# EAGLE design 4ch-v1.0 (EAGLE 5.06)
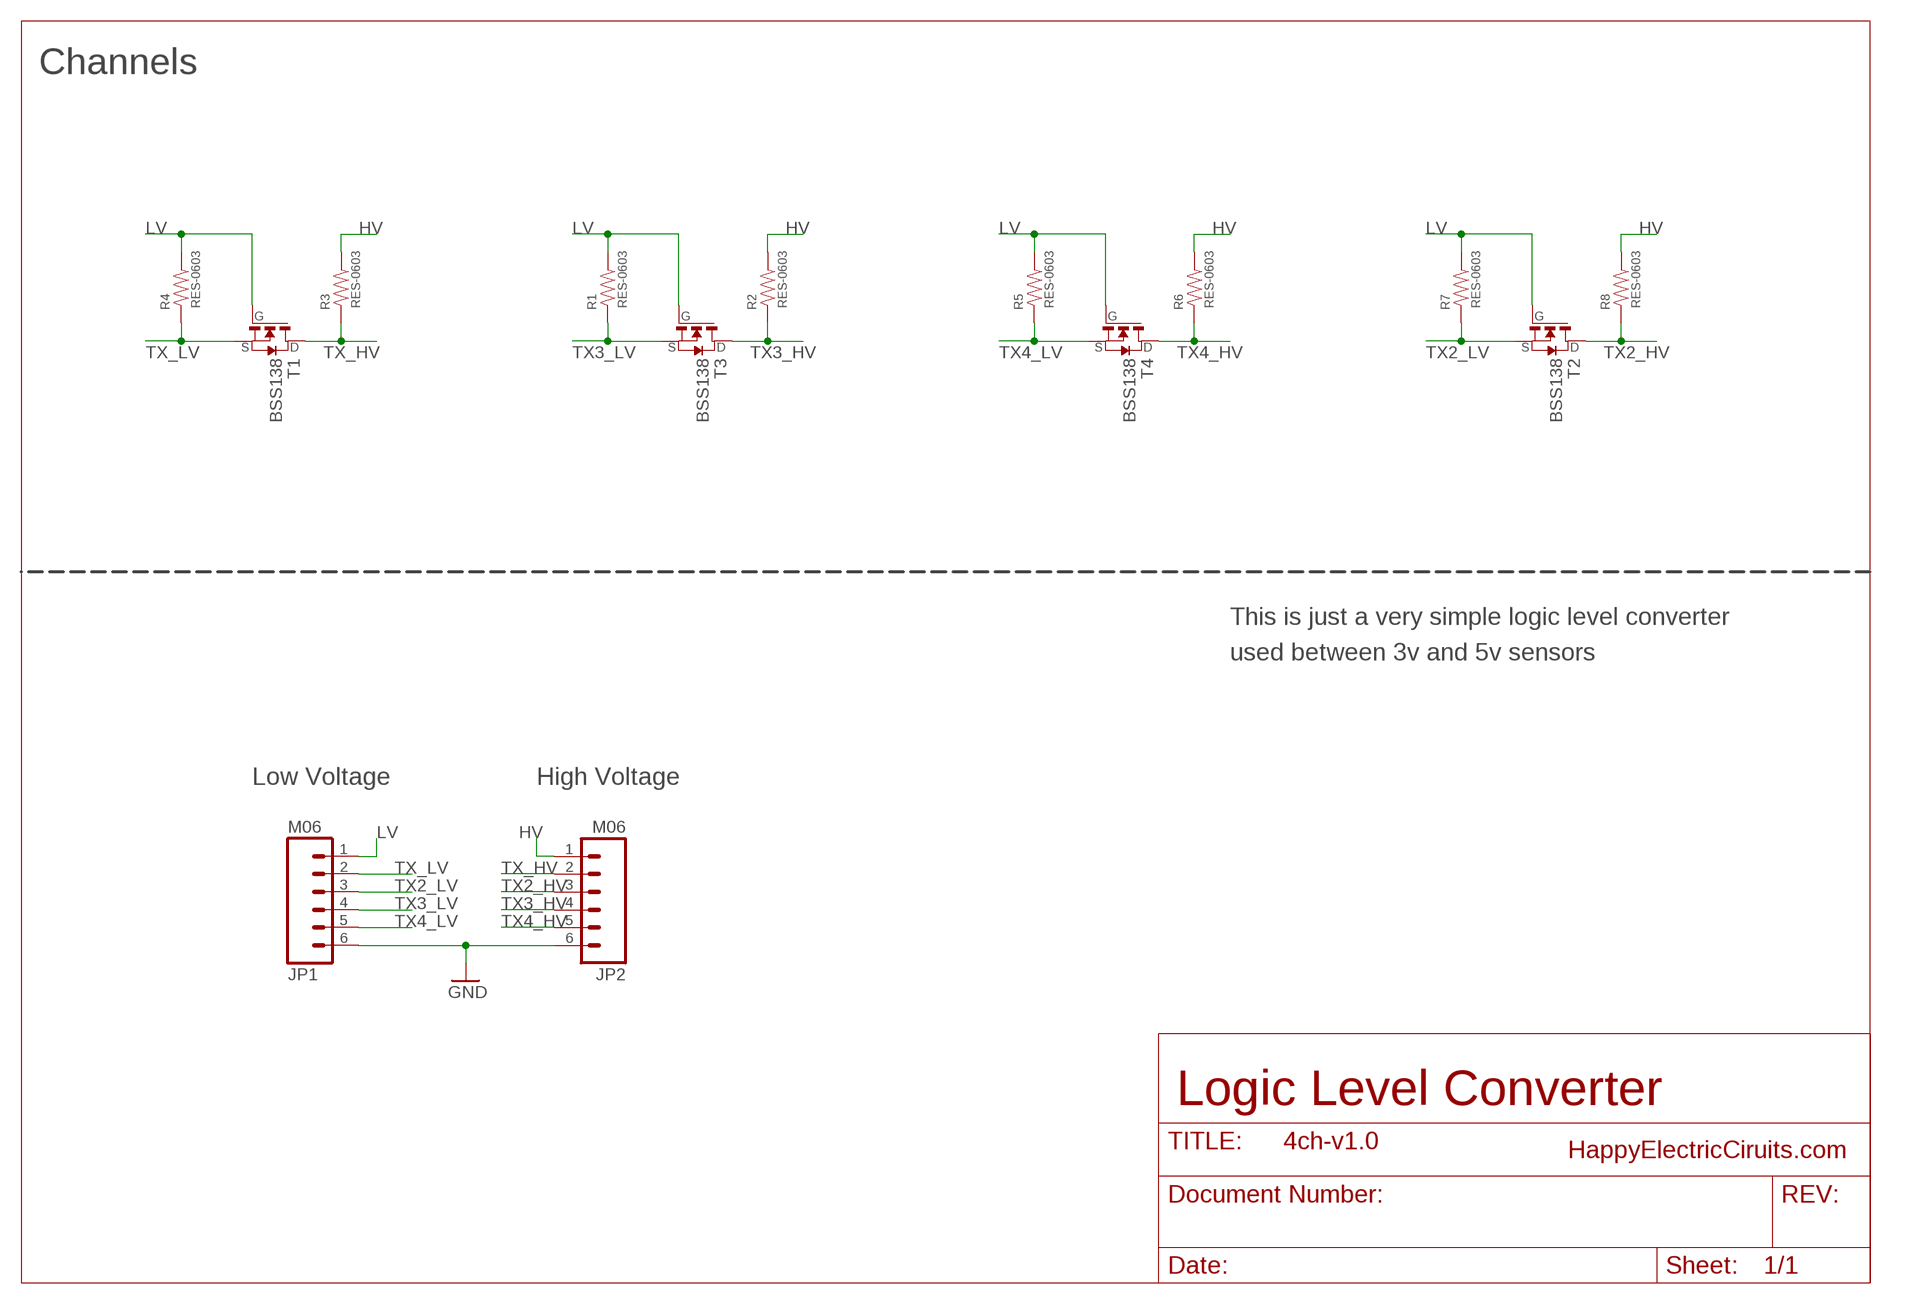
[diagram p0: schematic, sheet 1]

## Parts
JP1  M06  [M06]
JP2  M06  [M06]
R1  RES-0603  [0603-RES]
R2  RES-0603  [0603-RES]
R3  RES-0603  [0603-RES]
R4  RES-0603  [0603-RES]
R5  RES-0603  [0603-RES]
R6  RES-0603  [0603-RES]
R7  RES-0603  [0603-RES]
R8  RES-0603  [0603-RES]
T1  BSS138  [SOT-23]
T2  BSS138  [SOT-23]
T3  BSS138  [SOT-23]
T4  BSS138  [SOT-23]

## Nets
GND: JP1.6 JP2.6
HV: JP2.1 R2.1 R3.1 R6.1 R8.1
LV: JP1.1 R1.1 R4.1 R5.1 R7.1 T1.1(G) T2.1(G) T3.1(G) T4.1(G)
TX2_HV: JP2.3 R8.2 T2.3(D)
TX2_LV: JP1.3 R7.2 T2.2(S)
TX3_HV: JP2.4 R2.2 T3.3(D)
TX3_LV: JP1.4 R1.2 T3.2(S)
TX4_HV: JP2.5 R6.2 T4.3(D)
TX4_LV: JP1.5 R5.2 T4.2(S)
TX_HV: JP2.2 R3.2 T1.3(D)
TX_LV: JP1.2 R4.2 T1.2(S)

## Notes on the sheet
- Channels
- This is just a very simple logic level converter
- used between 3v and 5v sensors
- Low Voltage | High Voltage
- Logic Level Converter
- HappyElectricCiruits.com

## Library data of the parts
JP1 JP2 = Travis:M06
R1-R8 = Travis:RES-0603
T1-T4 = Travis:BSS138

## Board
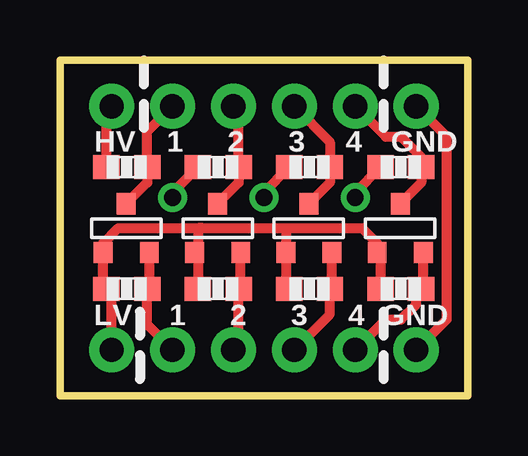
[diagram p1: board, top side]
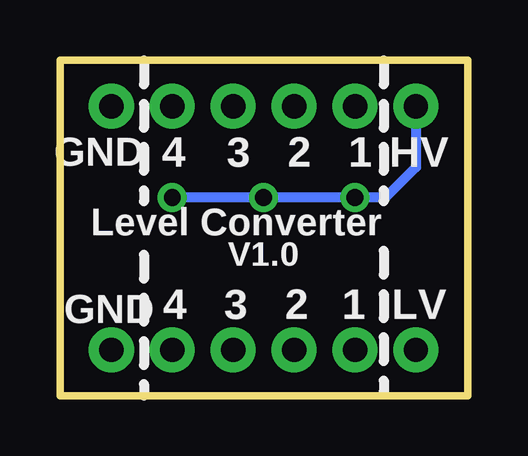
[diagram p2: board, bottom side, seen from below]

Size 17 x 14 mm. Coordinates in mm from the lower left corner, seen from the top.
Outline: 0,0 0,14 17,14 17,0 0,0
Copper layers (1*16): Top 0.035mm / dielectric 1.5mm / Bottom 0.035mm
Design rules "SparkFun *": minimum track width 8mil, minimum drill 20mil, track to track 8mil, track to pad 8mil, pad to pad 8mil, via to via 8mil, smd to smd 8mil, copper to edge 10mil, drill to drill 8mil, minimum pad ring 12mil, minimum via ring 10mil, stop-mask expansion 4mil, vias tented up to drill 28mil, thermal gap 10mil

### Footprints (pad centres in the part's own frame; a part is rotated, then mirrored left to right if it is on the bottom)
M06 = drill 1.016 pad 1.88 round: 1 0,0; 2 2.54,0; 3 5.08,0; 4 7.62,0; 5 10.16,0; 6 12.7,0
0603-RES = smd 1.1 x 1: 1 -0.85,0; 2 0.85,0
SOT-23 = smd 0.787 x 0.889: 1 -0.991,-1.016; 2 0.94,-1.016; 3 -0.025,1.016

### Placement (x,y rotation side)
JP1  2.15,1.91 0 top
JP2  2.15,12.06 0 top
R1  10.41,4.45 0 top
R2  10.41,9.53 0 top
R3  2.79,9.53 0 top
R4  2.79,4.45 0 top
R5  14.22,4.45 0 top
R6  14.22,9.53 0 top
R7  6.6,4.45 0 top
R8  6.6,9.53 0 top
T1  2.79,6.99 0 top
T2  6.6,6.99 0 top
T3  10.41,6.99 0 top
T4  14.22,6.99 0 top

### Tracks (layer width: path | path; a pad name or v marks a point on that pad's centre or on a via)
GND
  Top 0.406: JP2.6 16.12,10.79 16.12,3.17 JP1.6
HV  (via drill 0.7)
  Top 0.406: JP2.1 1.94,11.85 R3.1 | R6.1 12.31,8.47 v12.31,8.26 | R2.1 8.51,8.47 v8.51,8.26 | R8.1 4.7,8.47 v4.7,8.26
  Bottom 0.406: JP2.1 2.15,9.53 3.42,8.26 v4.7,8.26 v8.51,8.26 v12.31,8.26
LV
  Top 0.406: JP1.1 2.15,4.23 R4.1 1.8,4.45 T1.1 1.8,6.35 2.43,6.99 5.96,6.99 | 5.75,5.83 T2.1 | 5.75,5.83 R7.1 | R5.1 13.37,5.83 T4.1 13.23,6.35 12.59,6.99 9.14,6.99 | R1.1 9.42,4.45 T3.1 9.42,6.99 9.14,6.99 | 5.96,6.99 9.14,6.99 | 5.75,5.83 5.75,6.99 5.96,6.99
TX2_HV
  Top 0.406: JP2.3 7.45,11.85 R8.2 7.45,8.88 T2.3
TX2_LV
  Top 0.406: T2.2 7.54,4.54 R7.2 7.45,2.12 JP1.3
TX3_HV
  Top 0.406: JP2.4 11.26,10.58 R2.2 11.26,8.88 T3.3
TX3_LV
  Top 0.406: T3.2 11.35,4.54 R1.2 11.26,3.39 JP1.4
TX4_HV
  Top 0.406: JP2.5 13.59,10.79 14.22,10.79 15.07,9.95 R6.2 15.07,8.88 T4.3
TX4_LV
  Top 0.406: T4.2 15.16,4.54 R5.2 14.86,4.23 14.86,3.81 14.22,3.17 13.59,3.17 JP1.5
TX_HV
  Top 0.406: JP2.2 3.64,11.01 R3.2 3.64,8.88 T1.3
TX_LV
  Top 0.406: JP1.2 3.64,2.96 R4.2 3.73,4.54 T1.2

### Text on the board
tPlace: HV | 1 | 2 | 3 | 4 | GND | LV | 1 | 2 | 3 | 4 | GND
bPlace: HV | 1 | 2 | 3 | 4 | GND | Level Converter | V1.0 | LV | 1 | 2 | 3 | 4 | GND